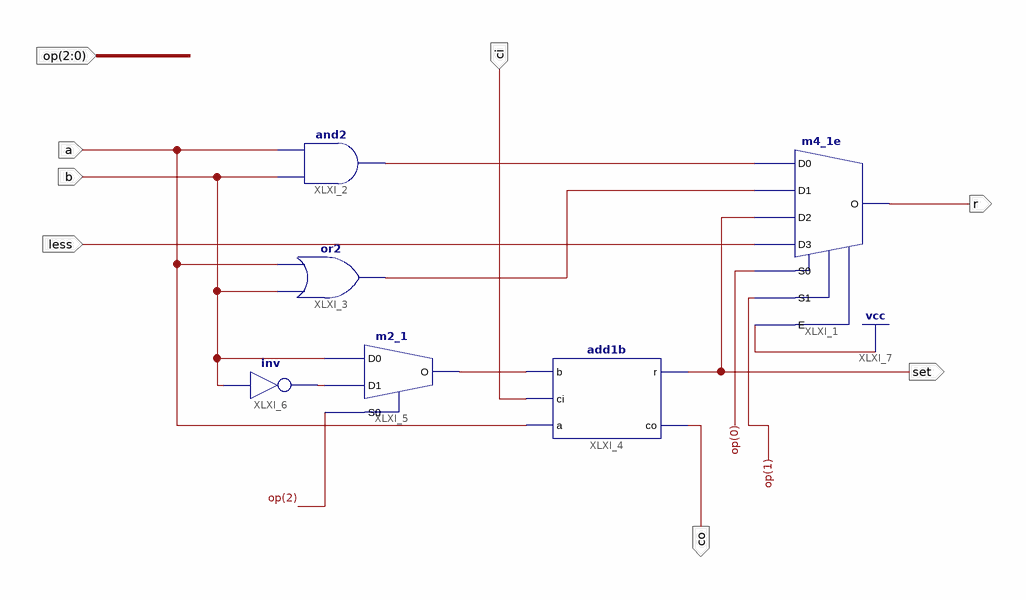
[diagram p0: schematic sheet 1]
// Xilinx ISE schematic alu1b.sch (spartan3e) as structural Verilog: 6 symbols, 8 ports
module alu1b (
  input  a,
  input  b,
  input  ci,
  input  less,
  input  [2:0] op,
  output set,
  output co,
  output r
);

  wire XLXN_3, XLXN_4, XLXN_6, XLXN_7;

  m4_1e XLXI_1 (.D0(XLXN_6), .D1(XLXN_7), .D2(set), .D3(less), .E(1'b1), .S0(op[0]), .S1(op[1]), .O(r));
  and XLXI_2 (XLXN_6, b, a);
  or XLXI_3 (XLXN_7, b, a);
  add1b XLXI_4 (.b(XLXN_4), .ci(ci), .a(a), .r(set), .co(co));
  m2_1 XLXI_5 (.D0(b), .D1(XLXN_3), .S0(op[2]), .O(XLXN_4));
  not XLXI_6 (XLXN_3, b);
endmodule
